# EAGLE design Atomic clock test board v1.1 (EAGLE 7.2.0)
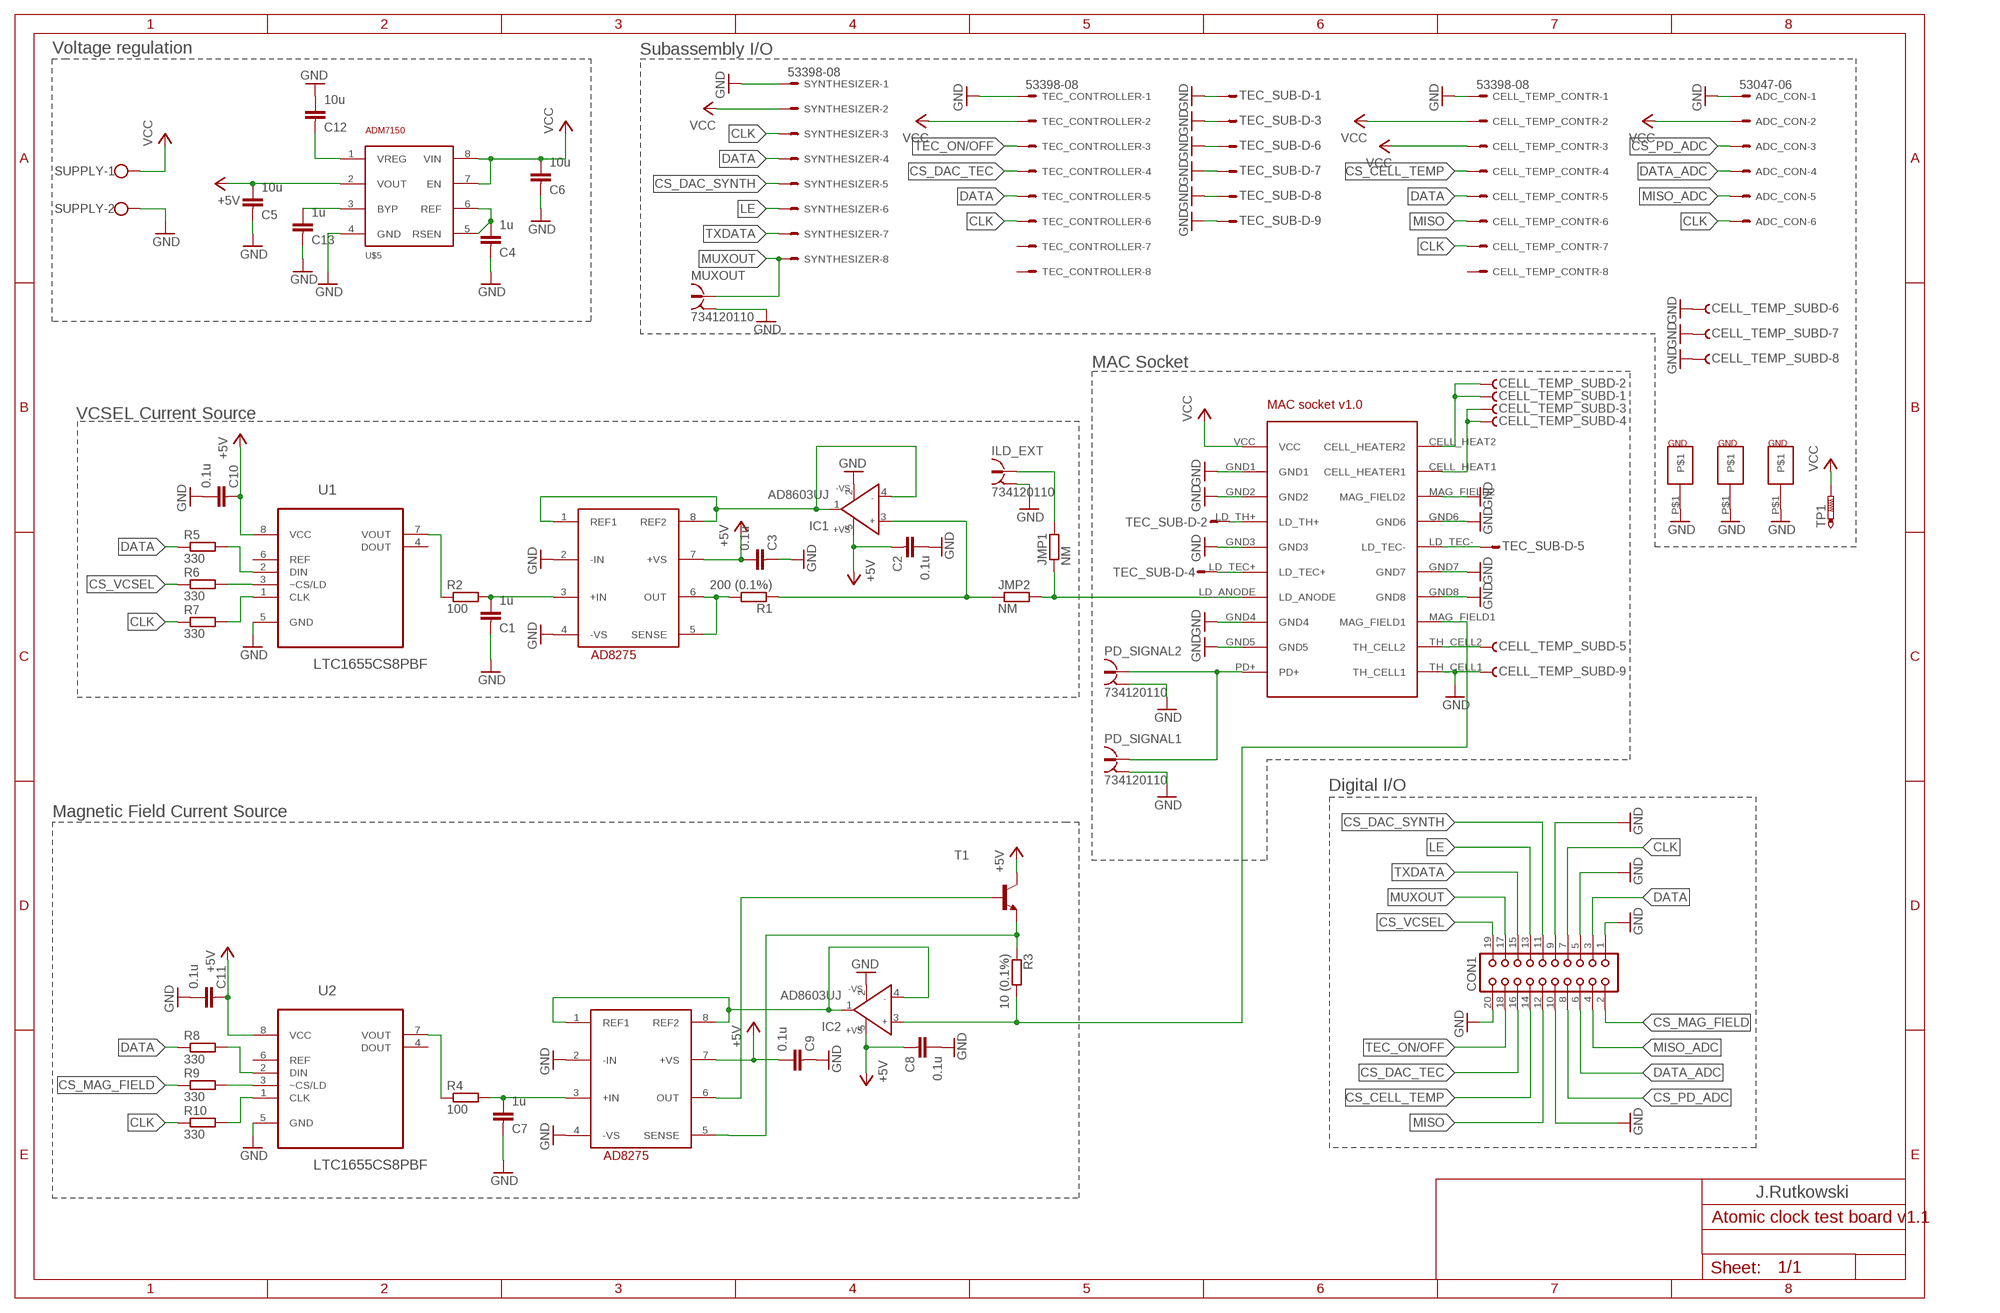
[diagram p0: schematic, sheet 1]

## Parts
ADC_CON  53047-06  [53047-06]
C1  1u  C-EUC0603K  [C0603K]
C2  0.1u  C-EUC0603K  [C0603K]
C3  0.1u  C-EUC0603K  [C0603K]
C4  1u  C-EUC0603K  [C0603K]
C5  10u  C-EUC0603K  [C0603K]
C6  10u  C-EUC0603K  [C0603K]
C7  1u  C-EUC0603K  [C0603K]
C8  0.1u  C-EUC0603K  [C0603K]
C9  0.1u  C-EUC0603K  [C0603K]
C10  0.1u  C-EUC0603K  [C0603K]
C11  0.1u  C-EUC0603K  [C0603K]
C12  10u  C-EUC0603K  [C0603K]
C13  1u  C-EUC0603K  [C0603K]
CELL_TEMP_CONTR  53398-08  [53398-08]
CELL_TEMP_SUBD  F09HPS  [F09HP]
CON1  CON20  [CON20]
IC1  AD8603UJ  [SOT23-5]
IC2  AD8603UJ  [SOT23-5]
ILD_EXT  734120110  [734120110]
JMP1  NM  R-EU_R0402  [R0402]
JMP2  NM  R-EU_R0402  [R0402]
MUXOUT  734120110  [734120110]
PD_SIGNAL1  734120110  [734120110]
PD_SIGNAL2  734120110  [734120110]
R1  200 (0.1%)  R-EU_R0603  [R0603]
R2  100  R-EU_R0603  [R0603]
R3  10 (0.1%)  R-EU_R0603  [R0603]
R4  100  R-EU_R0603  [R0603]
R5  330  R-EU_R0603  [R0603]
R6  330  R-EU_R0603  [R0603]
R7  330  R-EU_R0603  [R0603]
R8  330  R-EU_R0603  [R0603]
R9  330  R-EU_R0603  [R0603]
R10  330  R-EU_R0603  [R0603]
SUPPLY  W237-102  [W237-102]
SYNTHESIZER  53398-08  [53398-08]
T1  MMBT3904LT1-NPN-SOT23-BEC  [SOT23-BEC]
TEC_CONTROLLER  53398-08  [53398-08]
TEC_SUB-D  M09HPS  [M09HP]
TP1  PTR1PAD1-13  [P1-13]
U1  LTC1655CS8PBF  [SOIC127P600X175-8N]
U2  LTC1655CS8PBF  [SOIC127P600X175-8N]
U$1  MAC_MOUNT_V1  [MAC_MOUNT_PAC_V1]
U$2  AD8275  [MSOP08]
U$4  AD8275  [MSOP08]
U$5  ADM7150  [SO8]
U$6  GND_PAD  [GND_PAD]
U$7  GND_PAD  [GND_PAD]
U$8  GND_PAD  [GND_PAD]

## Nets
+5V: C2.2 C3.1 C5.1 C8.2 C9.1 C10.2 C11.2 IC1.5(+VS) IC2.5(+VS) T1.C U1.8(VCC) U2.8(VCC) U$2.7(+VS) U$4.7(+VS) U$5.2(VOUT)
CLK: ADC_CON.6 CELL_TEMP_CONTR.7 CON1.7 R7.1 R10.1 SYNTHESIZER.3 TEC_CONTROLLER.6
CS_CELL_TEMP: CELL_TEMP_CONTR.4 CON1.14
CS_DAC_SYNTH: CON1.11 SYNTHESIZER.5
CS_DAC_TEC: CON1.16 TEC_CONTROLLER.4
CS_MAG_FIELD: CON1.2 R9.1
CS_PD_ADC: ADC_CON.3 CON1.8
CS_VCSEL: CON1.19 R6.1
DATA: CELL_TEMP_CONTR.5 CON1.3 R5.1 R8.1 SYNTHESIZER.4 TEC_CONTROLLER.5
DATA_ADC: ADC_CON.4 CON1.6
GND: ADC_CON.1 C1.2 C2.1 C3.2 C4.2 C5.2 C6.2 C7.2 C8.1 C9.2 C10.1 C11.1 C12.1 C13.2 CELL_TEMP_CONTR.1 CELL_TEMP_SUBD.6 CELL_TEMP_SUBD.7 CELL_TEMP_SUBD.8 CELL_TEMP_SUBD.9 CON1.1 CON1.5 CON1.9 CON1.10 CON1.20 IC1.2(-VS) IC2.2(-VS) ILD_EXT.S@1 ILD_EXT.S@2 ILD_EXT.S@3 MUXOUT.S@1 MUXOUT.S@2 MUXOUT.S@3 PD_SIGNAL1.S@1 PD_SIGNAL1.S@2 PD_SIGNAL1.S@3 PD_SIGNAL2.S@1 PD_SIGNAL2.S@2 PD_SIGNAL2.S@3 SUPPLY.2 SYNTHESIZER.1 TEC_CONTROLLER.1 TEC_SUB-D.1 TEC_SUB-D.3 TEC_SUB-D.6 TEC_SUB-D.7 TEC_SUB-D.8 TEC_SUB-D.9 U1.5(GND) U2.5(GND) U$1.GND1 U$1.GND2 U$1.GND3 U$1.GND4 U$1.GND5 U$1.GND6 U$1.GND7 U$1.GND8 U$1.MAG_FIELD2 U$1.TH_CELL1 U$2.2(-IN) U$2.4(-VS) U$4.2(-IN) U$4.4(-VS) U$5.4(GND) U$6.P$1 U$7.P$1 U$8.P$1
LE: CON1.13 SYNTHESIZER.6
MISO: CELL_TEMP_CONTR.6 CON1.12
MISO_ADC: ADC_CON.5 CON1.4
MUXOUT: CON1.17 MUXOUT.1 SYNTHESIZER.8
N$1: C1.1 R2.2 U$2.3(+IN)
N$2: R1.2 U$2.5(SENSE) U$2.6(OUT)
N$3: IC1.3(IN+) JMP2.1 R1.1
N$4: IC1.1(OUT) IC1.4(IN-) U$2.1(REF1) U$2.8(REF2)
N$5: CELL_TEMP_SUBD.1 CELL_TEMP_SUBD.2 U$1.CELL_HEAT2(CELL_HEATER2)
N$7: R2.1 U1.7(VOUT)
N$8: T1.B U$4.6(OUT)
N$9: R3.1 T1.E U$4.5(SENSE)
N$10: IC2.1(OUT) IC2.4(IN-) U$4.1(REF1) U$4.8(REF2)
N$11: C7.1 R4.2 U$4.3(+IN)
N$12: R4.1 U2.7(VOUT)
N$13: IC2.3(IN+) R3.2 U$1.MAG_FIELD1
N$14: R5.2 U1.2(DIN)
N$15: R6.2 U1.3(~CS/LD)
N$16: R7.2 U1.1(CLK)
N$17: R8.2 U2.2(DIN)
N$18: R9.2 U2.3(~CS/LD)
N$19: R10.2 U2.1(CLK)
N$20: PD_SIGNAL1.1 PD_SIGNAL2.1 U$1.PD+
N$21: TEC_SUB-D.5 U$1.LD_TEC-
N$22: TEC_SUB-D.4 U$1.LD_TEC+
N$23: TEC_SUB-D.2 U$1.LD_TH+
N$24: CELL_TEMP_SUBD.3 CELL_TEMP_SUBD.4 U$1.CELL_HEAT1(CELL_HEATER1)
N$25: JMP1.1 JMP2.2 U$1.LD_ANODE
N$26: CELL_TEMP_SUBD.5 U$1.TH_CELL2
N$27: ILD_EXT.1 JMP1.2
N$28: C4.1 U$5.5(RSEN) U$5.6(REF)
N$29: C12.2 U$5.1(VREG)
N$30: C13.1 U$5.3(BYP)
TEC_ON/OFF: CON1.18 TEC_CONTROLLER.3
TXDATA: CON1.15 SYNTHESIZER.7
VCC: ADC_CON.2 C6.1 CELL_TEMP_CONTR.2 CELL_TEMP_CONTR.3 SUPPLY.1 SYNTHESIZER.2 TEC_CONTROLLER.2 TP1.TP U$1.VCC U$5.7(EN) U$5.8(VIN)
Unconnected: CELL_TEMP_CONTR.8 TEC_CONTROLLER.7 TEC_CONTROLLER.8 U1.4(DOUT) U1.6(REF) U2.4(DOUT) U2.6(REF)

## Notes on the sheet
- Voltage regulation | Subassembly I/O
- MAC Socket
- VCSEL Current Source
- Digital I/O
- Magnetic Field Current Source
- J.Rutkowski

## Library data of the parts
ADC_CON = con-molex:53?-06: CONNECTOR wire to board 1.25 mm (.049 inch) pitch header; MPN: 53047-0610-C; OC_FARNELL: 9733078; OC_NEWARK: 03M2965
C1-C13 = rcl:C-EU: CAPACITOR, European symbol
CELL_TEMP_CONTR SYNTHESIZER TEC_CONTROLLER = con-molex:53?-08: CONNECTOR wire to board 1.25 mm (.049 inch) pitch header; OC_FARNELL: 1125371; OC_NEWARK: unknown
CELL_TEMP_SUBD = con-subd:F09?S: SUB-D; OC_FARNELL: unknown; OC_NEWARK: unknown
CON1 = con-harting:CON20: CONNECTOR; OC_FARNELL: unknown; OC_NEWARK: unknown
IC1 IC2 = analog-devices:AD8603: Precision Micropower, Low Noise CMOS, Rail-to-Rail Input/Output Operational Amplifiers Source: http://www.analog.com/static/imported-files/data_sheets/AD8603_8607_8609.pdf; MF: ALTERA CORPORATION; MPN: AD8603AUJZ-REEL7; OC_FARNELL: 1651290; OC_NEWARK: 59K6904
ILD_EXT MUXOUT PD_SIGNAL1 PD_SIGNAL2 = con-coax:734120110: MICRO COAXIAL CONNECTOR RECEPTACLE VERTICAL Source: Data sheet <http://www.molex.com/pdm_docs/sd/734120110_sd.pdf>
JMP1 JMP2 R1-R10 = rcl:R-EU_: RESISTOR, European symbol
SUPPLY = con-wago-500:W237-102: WAGO SCREW CLAMP; MPN: 237-102; OC_FARNELL: unknown; OC_NEWARK: 70K9898
T1 = transistor:*-NPN-: NPN Transistror BF959 corrected 2008.03.06
TEC_SUB-D = con-subd:M09?S: SUB-D; OC_FARNELL: unknown; OC_NEWARK: unknown
TP1 = testpad:PTR1: TEST PIN
U1 U2 = LTC_By_element14_Batch_1:LTC1655CS8PBF: 16-Bit Rail-to-Rail Micropower DAC; MPN: LTC1655CS8#PBF; OC_FARNELL: 1663654; OC_NEWARK: 56M2907; PACKAGE: SOIC-8; SUPPLIER: Linear Technology
U$1 = MAC:MAC_MOUNT_V1
U$2 U$4 = Custom-parts:AD8275: G = 0.2, Level Translation, 16-Bit ADC Driver; OC_FARNELL: 2094193
U$5 = Custom-parts:ADM7150
U$6-U$8 = Custom-parts:GND_PAD

## Board
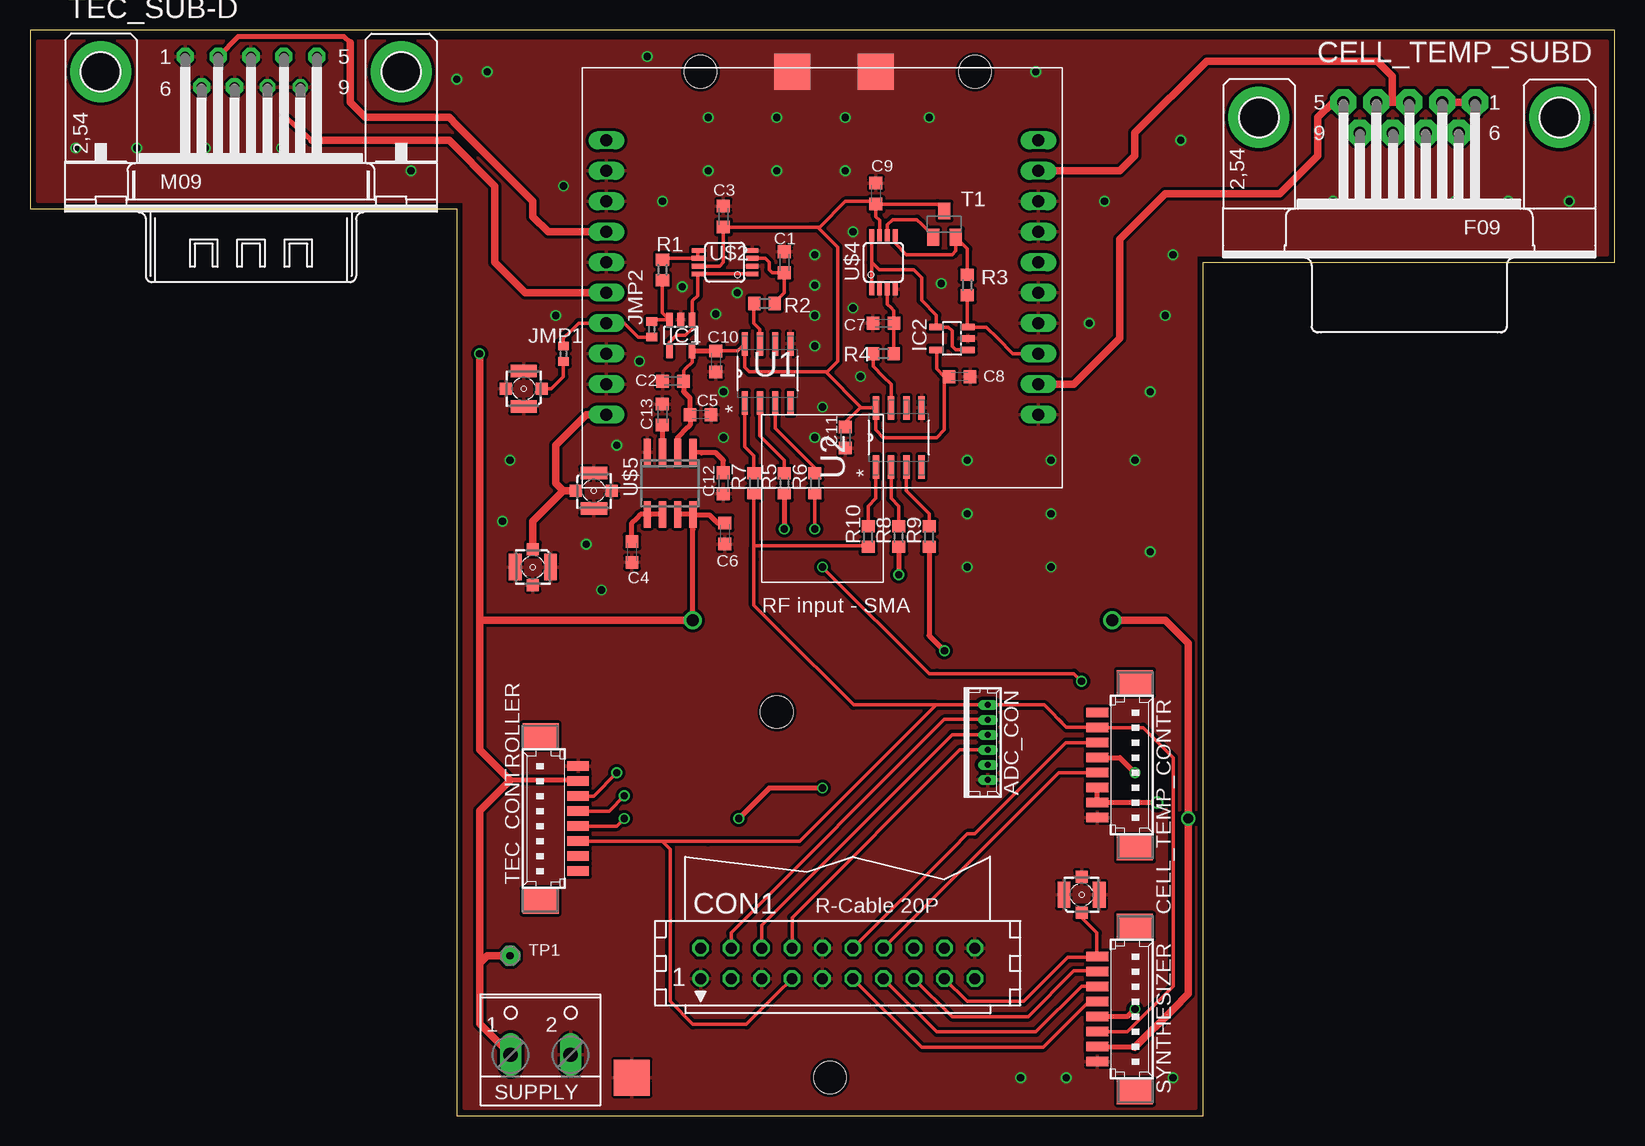
[diagram p1: board, top side]
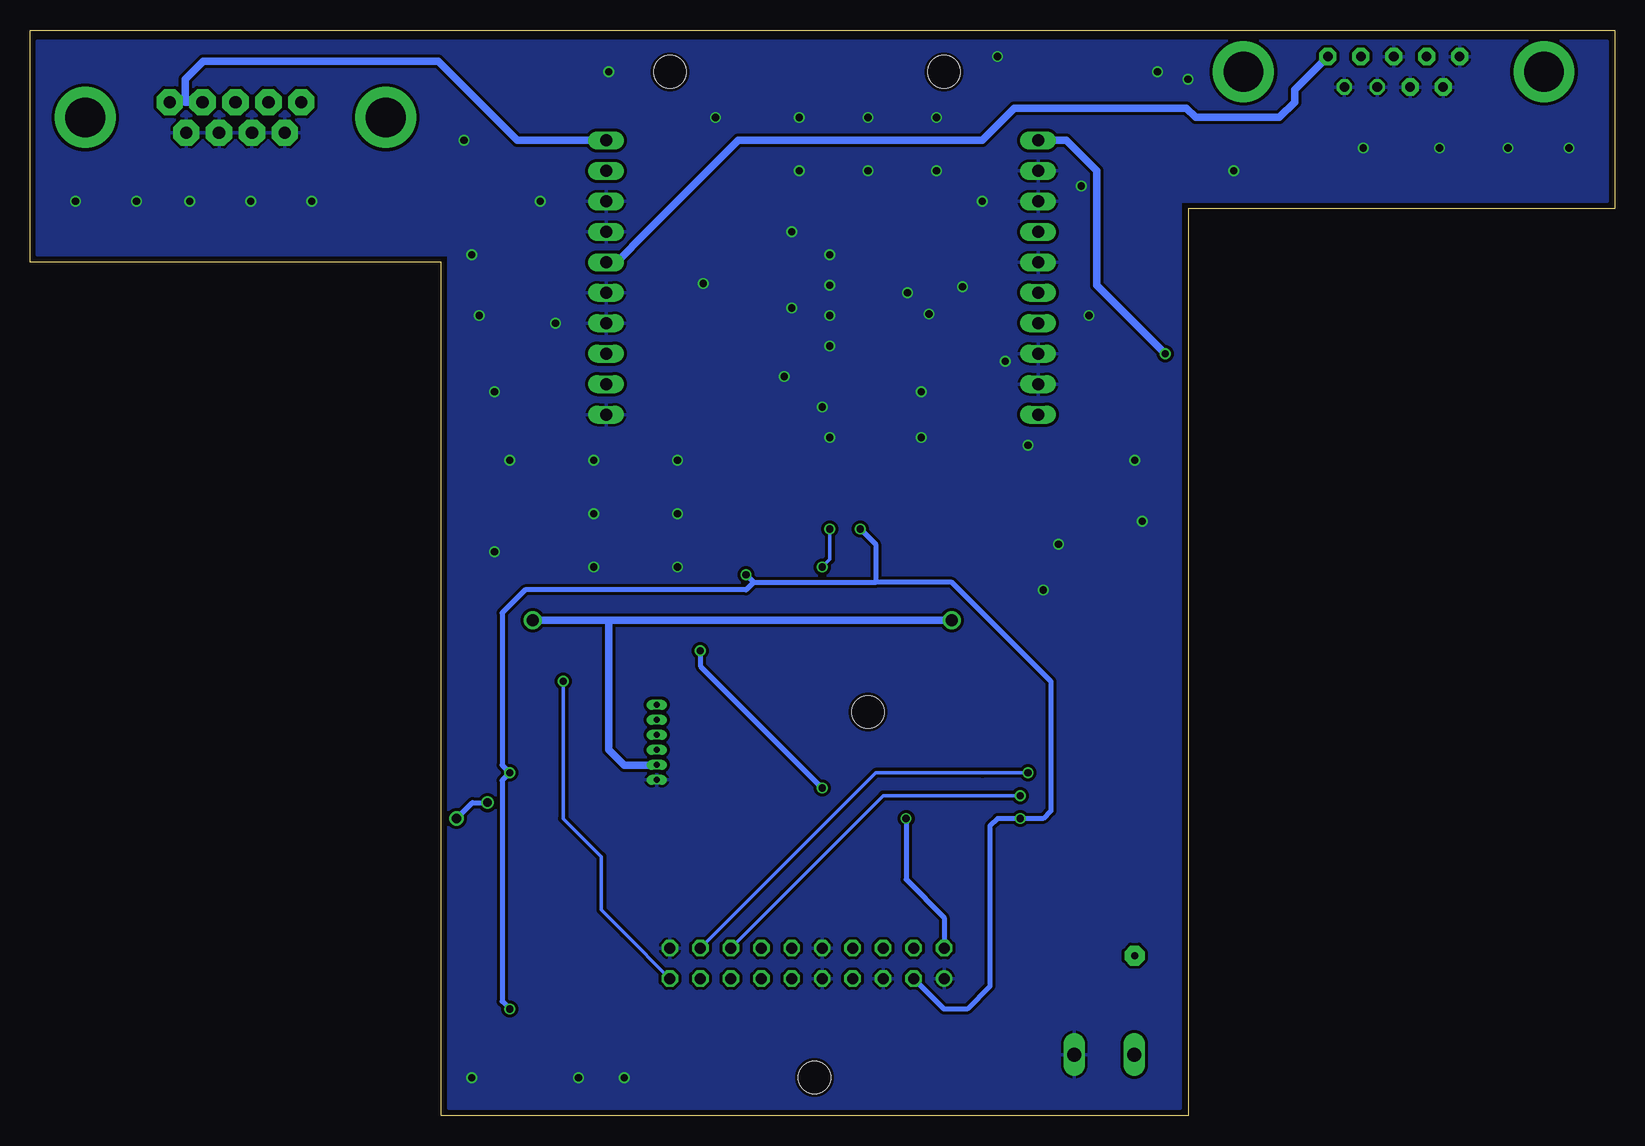
[diagram p2: board, bottom side, seen from below]

Size 132.06 x 90.47 mm. Coordinates in mm from the lower left corner, seen from the top.
Outline: 35.56,0 97.79,0 97.79,71.12 132.06,71.14 132.06,90.47 0,90.47 0,75.56 35.56,75.56 35.56,0
Copper layers (1*16): Top 0.018mm / dielectric 1.55mm / Bottom 0.018mm
Design rules "eC_2Layer_PClass6_BaseCopperO18_eCDefault *": minimum track width 0.15mm, minimum drill 0.35mm, track to track 0.15mm, track to pad 0.15mm, pad to pad 0.15mm, via to via 0.15mm, smd to smd 0mil, copper to edge 0.25mm, drill to drill 0.35mm, minimum pad ring 0.175mm, minimum via ring 0.125mm, stop-mask expansion 0mil, vias tented up to drill 0.45mm, thermal gap 0.2mm
Holes 2.7 mm at 55.88,87 78.74,87 66.67,3.17 62.23,33.66

### Footprints (pad centres in the part's own frame; a part is rotated, then mirrored left to right if it is on the bottom)
53047-06 = drill 0.5 pad 0.698 long: 1 3.125,0.45; 2 1.875,0.45; 3 0.625,0.45; 4 -0.625,0.45; 5 -1.875,0.45; 6 -3.125,0.45
C0603K = smd 1.05 x 1.08: 1 -0.875,0; 2 0.875,0
53398-08 = smd 0.8 x 1.8: 1 4.375,-2.5; 2 3.125,-2.5; 3 1.875,-2.5; 4 0.625,-2.5; 5 -0.625,-2.5; 6 -1.875,-2.5; 7 -3.125,-2.5; 8 -4.375,-2.5 | smd 2.1 x 3: S1 6.875,0.625; S2 -6.875,0.625
F09HP = drill 1.016 pad 2.184 octagon: 1 -5.486,-1.27; 2 -2.743,-1.27; 3 0,-1.27; 4 2.743,-1.27; 5 5.486,-1.27; 6 -4.115,1.27; 7 -1.372,1.27; 8 1.372,1.27; 9 4.115,1.27 | drill 3.302 pad 5.08: G1 -12.522,0; G2 12.522,0
CON20 = drill 0.914: 1 -11.43,-1.27 | drill 0.914 octagon: 2 -11.43,1.27; 3 -8.89,-1.27; 4 -8.89,1.27; 5 -6.35,-1.27; 6 -6.35,1.27; 7 -3.81,-1.27; 8 -3.81,1.27; 9 -1.27,-1.27; 10 -1.27,1.27; 11 1.27,-1.27; 12 1.27,1.27; 13 3.81,-1.27; 14 3.81,1.27; 15 6.35,-1.27; 16 6.35,1.27; 17 8.89,-1.27; 18 8.89,1.27; 19 11.43,-1.27; 20 11.43,1.27
SOT23-5 = smd 0.55 x 1.2: 1 -0.95,-1.3; 2 0,-1.3; 3 0.95,-1.3; 4 0.95,1.3; 5 -0.95,1.3
734120110 = smd 1 x 1: 1 0,-1.5; S@1 0,1.5 | smd 1.05 x 2.2: S@2 -1.475,0; S@3 1.475,0
R0402 = smd 0.7 x 0.9: 1 -0.65,0; 2 0.65,0
R0603 = smd 1 x 1.1: 1 -0.85,0; 2 0.85,0
W237-102 = drill 1.194 long: 1 -2.5,-1.27; 2 2.5,-1.27
SOT23-BEC = smd 1 x 1.4: B -0.95,-1.1; C 0,1.1; E 0.95,-1.1
M09HP = drill 0.8 pad 1.422 octagon: 1 -5.486,1.27; 2 -2.743,1.27; 3 0,1.27; 4 2.743,1.27; 5 5.486,1.27; 6 -4.115,-1.27; 7 -1.372,-1.27 | drill 0.8 pad 1.27 octagon: 8 1.372,-1.27; 9 4.115,-1.27 | drill 3.302 pad 5.08: G1 -12.522,0; G2 12.522,0
P1-13 = drill 0.6 pad 1.676 octagon: TP 0,0
SOIC127P600X175-8N = smd 1.981 x 0.533: 1 -2.464,1.905; 2 -2.464,0.635; 3 -2.464,-0.635; 4 -2.464,-1.905; 5 2.464,-1.905; 6 2.464,-0.635; 7 2.464,0.635; 8 2.464,1.905
MAC_MOUNT_PAC_V1 = drill 1 long: CELL_HEAT1 8.89,-18; CELL_HEAT2 11.43,-18; GND1 8.89,18; GND2 6.35,18; GND3 1.27,18; GND4 -6.35,18; GND5 -8.89,18; GND6 3.81,-18; GND7 -1.27,-18; GND8 -3.81,-18; LD_ANODE -3.81,18; LD_TEC+ -1.27,18; LD_TEC- 1.27,-18; LD_TH+ 3.81,18; MAG_FIELD1 -6.35,-18; MAG_FIELD2 6.35,-18; PD+ -11.43,18; TH_CELL1 -11.43,-18; TH_CELL2 -8.89,-18; VCC 11.43,18
MSOP08 = smd 0.4 x 1: 1 -0.976,-2.263; 2 -0.326,-2.263; 3 0.324,-2.263; 4 0.974,-2.263; 5 0.974,2.262; 6 0.324,2.262; 7 -0.326,2.262; 8 -0.976,2.262
SO8 = smd 0.6 x 2.2: 1 -1.905,-2.6; 2 -0.635,-2.6; 3 0.635,-2.6; 4 1.905,-2.6; 5 1.905,2.6; 6 0.635,2.6; 7 -0.635,2.6; 8 -1.905,2.6
GND_PAD = smd 3 x 3: P$1 0,0

### Placement (x,y rotation side)
ADC_CON  79.38,31.11 270 top
C1  62.87,71.12 90 top
C2  53.59,61.21 0 top
C3  57.78,74.93 90 top
C4  50.16,46.99 270 top
C5  55.88,58.42 0 top
C6  57.91,48.51 270 top
C7  71.12,66.04 180 top
C8  77.47,61.59 180 top
C9  70.48,76.83 90 top
C10  57.15,62.87 90 top
C11  67.94,56.52 90 top
C12  57.78,52.7 90 top
C13  52.7,58.42 90 top
CELL_TEMP_CONTR  91.44,29.21 270 top
CELL_TEMP_SUBD  114.94,83.19 180 top
CON1  67.31,12.7 0 top
IC1  54.23,65.02 180 top
IC2  76.83,64.77 90 top
ILD_EXT  41.15,60.58 90 top
JMP1  44.45,63.5 270 top
JMP2  51.82,65.53 270 top
MUXOUT  87.63,18.41 0 top
PD_SIGNAL1  46.99,52.07 270 top
PD_SIGNAL2  41.91,45.72 180 top
R1  52.7,70.48 90 top
R2  61.21,67.69 0 top
R3  78.11,69.22 270 top
R4  71.12,63.5 0 top
R5  62.87,52.7 90 top
R6  65.41,52.7 90 top
R7  60.33,52.7 90 top
R8  72.39,48.26 90 top
R9  74.93,48.26 90 top
R10  69.85,48.26 90 top
SUPPLY  42.55,6.35 0 top
SYNTHESIZER  91.44,8.89 270 top
T1  76.2,74.3 0 top
TEC_CONTROLLER  43.18,24.77 90 top
TEC_SUB-D  18.41,87 0 top
TP1  40.01,13.34 0 top
U1  61.47,61.85 90 top
U2  72.39,56.52 90 top
U$1  66.04,69.85 90 top
U$2  57.91,71.12 90 top
U$4  71.12,71.12 0 top
U$5  53.34,52.7 180 top
U$6  70.48,87 0 top
U$7  63.5,87 0 top
U$8  50.16,3.17 0 top

### Tracks (layer width: path | path; a pad name or v marks a point on that pad's centre or on a via)
+5V
  Top 0.305: U$2.7 57.46,70.79 57.78,71.12 C3.1 65.02,74.06 | C10.2 58.99,63.74 U1.8 | IC2.5 75.56,63.79 75.56,62.23 76.2,61.59 C8.2 76.2,61.2 76.2,57.15 75.56,56.52 71.12,56.52 70.48,57.15 U2.8 69.29,58.98 69.22,59.05 | T1.C 75.64,75.96 C9.1 70.48,74.93 | 70.79,74.62 U$4.7 70.79,74.62 | 70.79,74.62 70.48,74.93 | 69.22,59.05 66.29,61.98 | 66.29,61.98 59.94,61.98 | 59.94,61.98 59.69,62.23 | U1.8 59.56,62.36 | 59.56,62.36 59.69,62.23 | 70.79,74.62 70.48,74.93 | 70.48,74.93 70.48,76.2 67.94,76.2 65.8,74.06 65.02,74.06 | 65.02,74.06 65.64,74.06 67.31,72.39 67.31,62.87 66.42,61.98 66.29,61.98 | U1.8 59.56,62.36 | 59.56,62.36 59.69,62.23 | 59.69,62.23 59.94,61.98 | 59.94,61.98 66.29,61.98 | C11.2 67.94,57.78 69.22,59.05 | IC1.5 55.18,62.8 54.61,62.23 54.47,62.09 C2.2
  Top 0.406: C10.2 57.13,63.72 IC1.5 | U$5.2 53.98,56.52 54.86,57.4 55.01,57.55 C5.1 55.01,59.8 54.86,59.94 54.47,60.34 C2.2
CLK
  Top 0.305: R7.1 60.33,47.5 | 60.33,47.5 60.33,47.37 60.33,46.35 60.33,42.55 62.23,40.64 68.63,34.24 75.52,34.24 | 86.36,32.38 86.39,32.35 88.94,32.35 CELL_TEMP_CONTR.7 92.76,32.34 94.01,31.09 95.25,29.84 95.25,10.79 91.44,6.99 88.97,6.99 SYNTHESIZER.3 | 86.36,32.38 85.72,33.02 | 52.7,22.86 56.52,22.86 64.14,22.86 67.31,26.04 75.52,34.24 | 52.7,22.86 45.71,22.86 TEC_CONTROLLER.6 | CON1.7 62.23,10.16 59.69,7.62 55.24,7.62 53.34,9.53 53.34,22.23 52.7,22.86 | R10.1 69.76,47.5 60.33,47.5 | 75.52,34.24 ADC_CON.6 84.5,34.24 86.36,32.38
CS_CELL_TEMP
  Top 0.305: 77.47,20.32 77.15,20 | 77.15,20 CON1.14 | CELL_TEMP_CONTR.4 85.73,28.59 77.15,20
CS_DAC_SYNTH
  Top 0.305: CON1.11 74.3,5.71 84.45,5.71 88.27,9.53 SYNTHESIZER.5
CS_DAC_TEC  (via drill 0.6)
  Top 0.305: TEC_CONTROLLER.4 48.25,25.39 v49.53,26.67
  Bottom 0.305: v49.53,26.67 53.34,26.67 60.96,26.67 61.59,26.04 69.22,18.41 CON1.16
CS_MAG_FIELD  (via drill 0.6)
  Top 0.406: R9.1 74.93,40.01 v76.2,38.73 | v66.04,27.3 61.59,27.3 v59.05,24.77
  Bottom 0.406: v76.2,38.73 76.2,37.47 v66.04,27.3 | v59.05,24.77 59.05,19.68 55.88,16.51 CON1.2
CS_PD_ADC
  Top 0.305: ADC_CON.3 79.81,30.48 77.47,30.48 63.5,16.51 CON1.8
CS_VCSEL  (via drill 0.6)
  Top 0.305: R6.1 v65.41,48.9 | v66.04,45.72 74.93,36.83 75.56,36.83 87,36.83 v87.63,36.2
  Bottom 0.305: v65.41,48.9 65.41,46.35 v66.04,45.72 | v87.63,36.2 87.63,24.77 84.45,21.59 84.45,17.14 82.55,15.24 CON1.19
DATA  (via drill 0.6)
  Top 0.305: 92.06,28.59 v92.08,28.57 | TEC_CONTROLLER.5 48.91,24.14 v49.53,24.77
  Top 0.406: R5.1 v62.87,48.9 | R8.1 v72.39,45.09 | v92.08,8.89 91.45,8.27 SYNTHESIZER.4 | CELL_TEMP_CONTR.5 90.81,29.84 v92.08,28.57
  Bottom 0.406: v62.87,48.9 61.59,47.62 61.59,44.45 | v72.39,45.09 71.75,44.45 | 71.75,44.45 61.59,44.45 | 71.75,44.45 72.39,43.81 90.81,43.81 92.71,41.91 92.71,29.21 v92.08,28.57 92.71,27.94 92.71,9.53 v92.08,8.89 | 61.59,44.45 55.24,44.45 46.99,36.2 46.99,31.11 46.99,25.4 47.62,24.77 v49.53,24.77 51.44,24.77 52.07,24.13 52.07,19.05 52.07,10.79 53.98,8.89 55.88,8.89 CON1.3
DATA_ADC
  Top 0.305: ADC_CON.4 79.81,31.75 76.83,31.75 60.96,15.88 CON1.6
GND  (via drill 0.6)
  other vias: 3.81,80.64 8.89,80.64 14.61,80.64 20.95,80.64 31.75,78.74 35.56,86.36 51.44,88.27 56.52,83.19 62.23,83.19 67.94,83.19 52.7,76.2 56.52,78.74 62.23,78.74 67.94,78.74 83.82,87 65.41,71.75 68.58,73.66 74.93,83.19 95.89,81.28 89.53,76.2 85.09,50.16 108.58,76.2 113.67,76.2 118.75,76.2 123.19,76.2 128.27,76.2 95.25,71.75 88.27,66.04 94.61,66.67 54.36,69.09 65.41,69.22 68.58,67.31 65.41,66.67 65.41,64.14 69.22,61.59 66.04,59.05 50.8,62.87 57.78,60.33 65.41,56.52 43.81,66.67 40.01,54.61 39.37,49.53 48.9,55.88 46.35,47.62 47.62,43.81 57.78,56.52 92.08,54.61 93.34,60.33 78.11,54.61 93.34,46.99 82.55,3.17 86.36,3.17 95.25,3.17 75.95,69.34 57.15,66.8 58.93,68.58 44.45,77.47 38.1,87 85.09,54.61 85.09,45.72 78.11,45.72 78.11,50.16
  pour Top (isolate 0.254): 0.64,89.53 131.44,89.53 131.44,71.75 97.16,71.75 97.16,0.64 36.2,0.64 36.2,76.2 0.64,76.2
  pour Bottom (isolate 0.254): 0.64,89.53 131.44,89.53 131.44,71.75 97.16,71.75 97.16,0.64 36.2,0.64 36.2,76.2 0.64,76.2
  pour Top (no thermals): 60.33,89.53 60.33,84.45 73.03,84.45 73.66,84.45 73.66,89.53
LE
  Top 0.305: CON1.13 75.56,6.99 83.82,6.99 87.63,10.79 88.91,10.79 SYNTHESIZER.6
MISO
  Top 0.305: CON1.12 76.83,22.23 78.11,23.5 78.74,23.5 86.33,31.09 CELL_TEMP_CONTR.6
MISO_ADC
  Top 0.305: ADC_CON.5 79.8,33.02 76.2,33.02 58.42,15.24 CON1.4
MUXOUT
  Top 0.305: SYNTHESIZER.8 89.5,13.34 | SYNTHESIZER.8 88.9,13.3 88.9,15.24 87.63,16.51 MUXOUT.1 | CON1.17 78.11,9.53 82.8,9.53 86.49,13.21 88.88,13.21 SYNTHESIZER.8
N$1
  Top 0.305: U$2.3 61.27,71.44 61.59,71.12 61.59,70.48 61.84,70.25 C1.1 62.87,68.58 62.06,67.78 R2.2
N$2
  Top 0.305: U$2.5 U$2.6 52.81,71.44 R1.2
N$3
  Top 0.305: R1.1 52.7,67.94 52.7,66.9 IC1.3 51.96,66.32 JMP2.1
N$4
  Top 0.305: U$2.1 U$2.8 55.65,68.35 55.24,67.94 55.18,67.88 IC1.1 55.18,65.59 54.61,65.02 53.85,65.02 53.34,64.52 53.28,64.45 IC1.4
N$5
  Top 0.61: CELL_TEMP_SUBD.2 CELL_TEMP_SUBD.1
  Bottom 0.61: CELL_TEMP_SUBD.2 119.13,84.45 119.13,86.36 117.6,87.88 98.04,87.88 92.08,81.92 91.44,81.28 U$1.CELL_HEAT2
N$7
  Top 0.305: U1.7 60.83,65.53 60.33,66.04 60.33,67.65 R2.1
N$8
  Top 0.305: T1.B 75.1,73.19 74.93,73.03 74.93,73.66 74.3,74.3 73.91,74.68 71.88,74.68 71.44,74.24 U$4.6
N$9
  Top 0.305: R3.1 78.11,72.24 T1.E 77.15,72.07 76.83,71.75 73.03,71.75 72.09,72.69 U$4.5
N$10
  Top 0.305: U$4.8 70.14,71.12 | 70.14,71.12 U$4.1 | 70.14,71.12 70.78,70.48 73.66,70.48 74.3,69.85 74.3,67.94 75.53,66.7 IC2.4 76.52,65.72 76.83,65.41 76.83,64.77 76.83,64.14 77.15,63.82 IC2.1
N$11
  Top 0.305: R4.2 72,63.52 C7.1 72,67.07 71.75,67.31 71.44,67.62 U$4.3
N$12
  Top 0.305: U2.7 71.75,60.96 71.12,61.59 70.27,62.45 R4.1
N$13
  Top 0.305: U$1.MAG_FIELD1 81.92,63.5 80.64,64.77 79.69,65.72 IC2.3 78.11,65.75 R3.2
N$14
  Top 0.305: U1.2 60.83,56.64 61.59,55.88 62.23,55.24 62.87,54.61 R5.2
N$15
  Top 0.305: U1.3 62.1,57.28 63.5,55.88 64.14,55.24 65.41,53.98 R6.2
N$16
  Top 0.305: R7.2 60.33,54.99 59.69,55.63 59.56,55.75 U1.1
N$17
  Top 0.305: U2.2 71.75,51.44 72.39,50.8 R8.2
N$18
  Top 0.305: U2.3 73.03,52.07 74.3,50.8 74.93,50.16 R9.2
N$19
  Top 0.305: U2.1 70.48,51.44 69.85,50.8 R10.2
N$20
  Top 0.61: U$1.PD+ 46.35,58.42 44.45,56.52 43.81,55.88 43.81,52.7 44.45,52.07 | 44.45,52.07 PD_SIGNAL1.1 | PD_SIGNAL2.1 41.91,49.53 44.45,52.07
N$21
  Bottom 0.61: U$1.LD_TEC- 83.19,71.12 80.64,73.66 75.56,78.74 73.03,81.28 52.7,81.28 50.04,83.95 38.23,83.95 35.69,83.95 34.92,83.19 27.94,83.19 26.67,84.45 26.67,85.5 TEC_SUB-D.5
N$22
  Top 0.305: TEC_SUB-D.4 21.16,83.39
  Top 0.406: 21.16,83.39 23.5,81.28
  Top 0.61: 23.5,81.28 34.92,81.28 38.73,77.47 38.73,71.12 41.27,68.58 U$1.LD_TEC+
N$23
  Top 0.406: 26.67,89.41 26.16,89.92 17.32,89.92 TEC_SUB-D.2
  Top 0.61: U$1.LD_TH+ 43.18,73.66 41.91,74.93 41.91,76.2 35.56,82.55 34.92,83.19 27.94,83.19 27.3,83.82 26.67,84.45 26.67,89.41
N$24
  Top 0.61: CELL_TEMP_SUBD.3 CELL_TEMP_SUBD.4 113.54,84.45 113.54,86.61 112.27,87.88 98.04,87.88 92.08,81.92 92.08,80.01 90.81,78.74 U$1.CELL_HEAT1
N$25
  Top 0.305: JMP2.2 50.69,64.88 50.16,65.41 49.53,66.04 U$1.LD_ANODE 45.72,66.04 45.09,65.41 44.45,64.77 JMP1.1
N$26
  Top 0.61: CELL_TEMP_SUBD.5 108.58,84.45 107.31,83.19 107.31,80.01 104.14,76.83 94.61,76.83 90.81,73.03 90.81,64.77 87,60.96 U$1.TH_CELL2
N$27
  Top 0.305: ILD_EXT.1 43.43,60.58 44.45,61.59 JMP1.2
N$28
  Top 0.406: U$5.6 51.77,50.1 | 51.77,50.1 U$5.5 51.77,50.1 | 51.77,50.1 50.87,50.1 50.55,49.78 50.16,49.4 C4.1
N$29
  Top 0.406: C12.2 57.78,54.61 57.15,55.24 55.94,55.24 U$5.1
N$30
  Top 0.406: C13.1 U$5.3
TEC_ON/OFF  (via drill 0.6)
  Top 0.305: TEC_CONTROLLER.3 46.96,26.64 v48.9,28.57
  Bottom 0.305: v48.9,28.57 52.7,28.57 61.59,28.57 62.87,27.3 71.12,19.05 CON1.18
TXDATA
  Top 0.305: CON1.15 76.83,8.26 83.19,8.26 87,12.06 88.89,12.06 SYNTHESIZER.7
VCC  (via drill 0.6, 0.7, 0.8, 1)
  Top 0.305: 88.27,5.71 88.89,5.71 SYNTHESIZER.2
  Top 0.406: 92.08,5.71 88.27,5.71 | v93.93,26.09 CELL_TEMP_CONTR.2 CELL_TEMP_CONTR.3 | TEC_CONTROLLER.2 45.63,27.94 40.01,27.94 | v55.24,41.27 55.24,48.84 U$5.8 | U$5.8 U$5.7 | C6.1 57.29,49.39 57.15,49.53 56.9,49.78 56.64,50.04 55.31,50.04 U$5.8
  Top 0.61: 92.08,5.71 95.25,8.89 96.52,10.16 96.52,10.79 v96.52,24.77 96.52,39.37 94.61,41.27 v90.17,41.27 | 37.47,41.27 37.47,30.48 40.01,27.94 37.47,25.4 37.47,12.7 | 37.47,41.27 v37.47,63.5 | SUPPLY.1 37.47,7.66 37.47,12.7 | v55.24,41.27 37.47,41.27 | TP1.TP 38.1,13.34 37.47,12.7
  Bottom 0.406: v96.52,24.77 95.2,26.09 v93.93,26.09
  Bottom 0.61: U$1.VCC 45.72,81.28 43.18,78.74 43.18,69.22 v37.47,63.5 | v55.24,41.27 63.5,41.27 69.22,41.27 71.12,41.27 83.82,41.27 | 83.82,41.27 v90.17,41.27 | ADC_CON.2 79.86,29.21 82.55,29.21 83.82,30.48 83.82,41.27

### Text on the board
Top_Legend: LD TEC Analog I/O | T1 | C9 | C3 | C1 | Cell Temp Analog I/O | R1 | 1 | U$2 | U$4 | 1 | R3 | R2 | C10 | IC2 | C7 | JMP1 | JMP2 | R4 | C2 | U1 | C5 | C8 | ILD_Ext | U2 | C13 | 1 | R5 | C11 | R6 | 1 | R8 | R7 | U$5 | C4 | R9 | Sig_OUT | C12 | R10 | C6 | FEMTO-ST 2016 / MAC Demonstrator Rev. 1.1 | 1 | Cell Temp Dig I/O | ADC Dig I/O | 1 | LD TEC Dig I/O | MUXOUT | + | GND | Master Dig I/O | Synth Dig I/O | 1 | Supply
Bottom_Legend: LD TEC Analog I/O | Cell Temp Analog I/O | FEMTO-ST 2016 / MAC Demonstrator v1.1 | + | GND